# EAGLE schematic central (EAGLE 6.1)
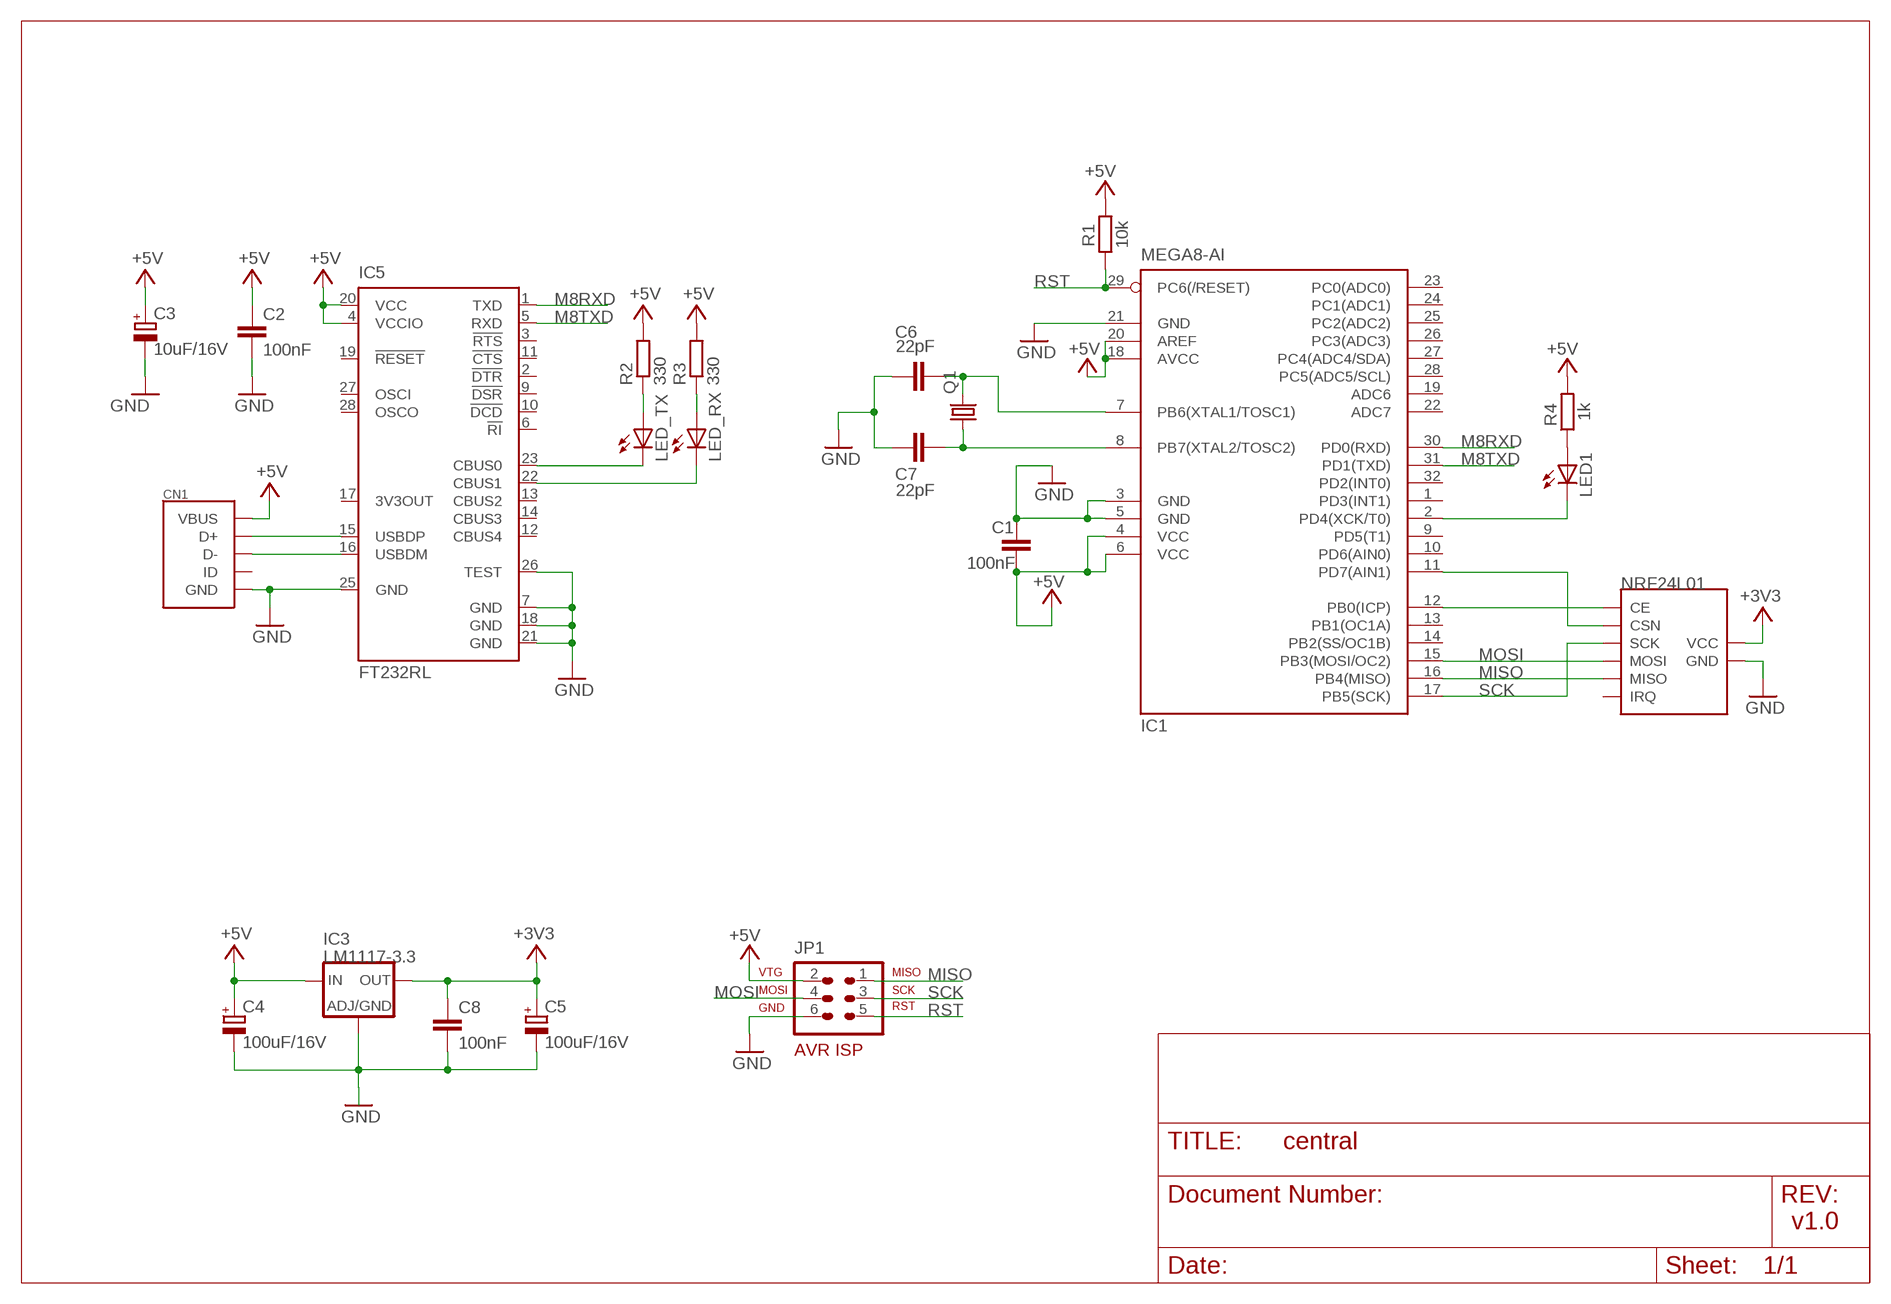
[diagram p0: schematic, sheet 1]

## Parts
C1  100nF  C-EUC0805K  [C0805K]
C2  100nF  C-EUC0805K  [C0805K]
C3  10uF/16V  CPOL-EUPD  [PANASONIC_D]
C4  100uF/16V  CPOL-EUPD  [PANASONIC_D]
C5  100uF/16V  CPOL-EUPD  [PANASONIC_D]
C6  22pF  C-EUC0805K  [C0805K]
C7  22pF  C-EUC0805K  [C0805K]
C8  100nF  C-EUC0805K  [C0805K]
CN1  USBMINIB  [USB-MINIB]
IC1  MEGA8-AI  [TQFP32-08]
IC3  LM1117-3.3  LM1117S  [SOT223]
IC4  NRF24L01  NRF24L01-MODULE  [NRF24L01-MODULE]
IC5  FT232RL  [SSOP28]
JP1  AVR-ISP-6  [AVR-ISP-6]
LED1  LED3MM  [LED3MM]
LED_RX  LED0805  [CHIP-LED0805]
LED_TX  LED0805  [CHIP-LED0805]
Q1  CRYSTALHC49UP  [HC49UP]
R1  10k  R-EU_R0805  [R0805]
R2  330  R-EU_R0805  [R0805]
R3  330  R-EU_R0805  [R0805]
R4  1k  R-EU_7  [0207/7]

## Nets
+3V3: C5.+ C8.1 IC3.2(OUT) IC3.4(OUT) IC4.2(VCC)
+5V: C1.2 C2.1 C3.+ C4.+ CN1.VBUS IC1.4(VCC) IC1.6(VCC) IC1.18(AVCC) IC1.20(AREF) IC3.3(IN) IC5.4(VCCIO) IC5.20(VCC) JP1.2(VTG) R1.2 R2.2 R3.2 R4.2
GND: C1.1 C2.2 C3.- C4.- C5.- C6.1 C7.1 C8.2 CN1.GND IC1.3(GND) IC1.5(GND) IC1.21(GND) IC3.1(ADJ) IC4.1(GND) IC5.7(GND) IC5.18(GND) IC5.21(GND) IC5.25(GND) IC5.26(TEST) JP1.6(GND)
M8RXD: IC1.30(PD0(RXD)) IC5.1(TXD)
M8TXD: IC1.31(PD1(TXD)) IC5.5(RXD)
MISO: IC1.16(PB4(MISO)) IC4.7(MISO) JP1.1(MISO)
MOSI: IC1.15(PB3(MOSI/OC2)) IC4.6(MOSI) JP1.4(MOSI)
N$1: LED_TX.A R2.1
N$2: IC1.12(PB0(ICP)) IC4.3(CE)
N$3: CN1.D- IC5.16(USBDM)
N$4: IC1.11(PD7(AIN1)) IC4.4(CSN)
N$5: C7.2 IC1.8(PB7(XTAL2/TOSC2)) Q1.1
N$6: C6.2 IC1.7(PB6(XTAL1/TOSC1)) Q1.2
N$7: CN1.D+ IC5.15(USBDP)
N$8: LED_RX.A R3.1
N$9: IC5.23(CBUS0) LED_TX.C
N$10: IC1.2(PD4(XCK/T0)) LED1.K(C)
N$11: LED1.A R4.1
N$12: IC5.22(CBUS1) LED_RX.C
RST: IC1.29(PC6(/RESET)) JP1.5(RST) R1.1
SCK: IC1.17(PB5(SCK)) IC4.5(SCK) JP1.3(SCK)
Unconnected: CN1.ID IC1.1(PD3(INT1)) IC1.9(PD5(T1)) IC1.10(PD6(AIN0)) IC1.13(PB1(OC1A)) IC1.14(PB2(SS/OC1B)) IC1.19(ADC6) IC1.22(ADC7) IC1.23(PC0(ADC0)) IC1.24(PC1(ADC1)) IC1.25(PC2(ADC2)) IC1.26(PC3(ADC3)) IC1.27(PC4(ADC4/SDA)) IC1.28(PC5(ADC5/SCL)) IC1.32(PD2(INT0)) IC4.8(IRQ) IC5.2(!DTR) IC5.3(!RTS) IC5.6(!RI) IC5.9(!DSR) IC5.10(!DCD) IC5.11(!CTS) IC5.12(CBUS4) IC5.13(CBUS2) IC5.14(CBUS3) IC5.17(3V3OUT) IC5.19(!RESET) IC5.27(OSCI) IC5.28(OSCO)

## Notes on the sheet
- v1.0

## Library data of the parts
C1 C2 C6-C8 = potinho:C-EU: CAPACITOR, European symbol
C3-C5 = potinho:CPOL-EU: POLARIZED CAPACITOR, European symbol
CN1 = potinho:USB: USB Connectors USBMINIB - Surface Mount Female Mini-B USB Connector 4UConnector: 06564 By microbuilder.eu Thru-hole RA Female Mini-B USB Connector 4UConnector: 18732 By ladyada.net
IC1 = potinho:MEGA8: MICROCONTROLLER 8 Kbytes FLASH, 1 kbytes SRAM, 512 bytes EEPROM, USART, 6-channel 10 bit ADC, 2-channel 8 bit ADC Pin compatible with Atmega48, ATMega88, ATMega168 Source: avr.lbr; MPN: ATMEGA8-16AU; OC_FARNELL: 9171371; OC_NEWARK: 73M8863
IC3 = potinho:LM1117: Low drop fixed and adjustable positive voltage regulators 1 A Source: http://www.st.com/stonline/products/literature/ds/7194/ld1117axx.pdf
IC4 = potinho:NRF24L01-MODULE
IC5 = potinho:FT232R: Source: http://www.ftdichip.com/Documents/DataSheets/DS_FT232R_v104.pdf; MPN: FT232RL; OC_FARNELL: 1146032; OC_NEWARK: 91K9918
JP1 = potinho:AVR-ISP-6: AVR ISP-6 Serial Programming Header
LED1 LED_RX LED_TX = potinho:LED
Q1 = potinho:CRYSTAL: CRYSTAL
R1-R4 = potinho:R-EU_: RESISTOR, European symbol